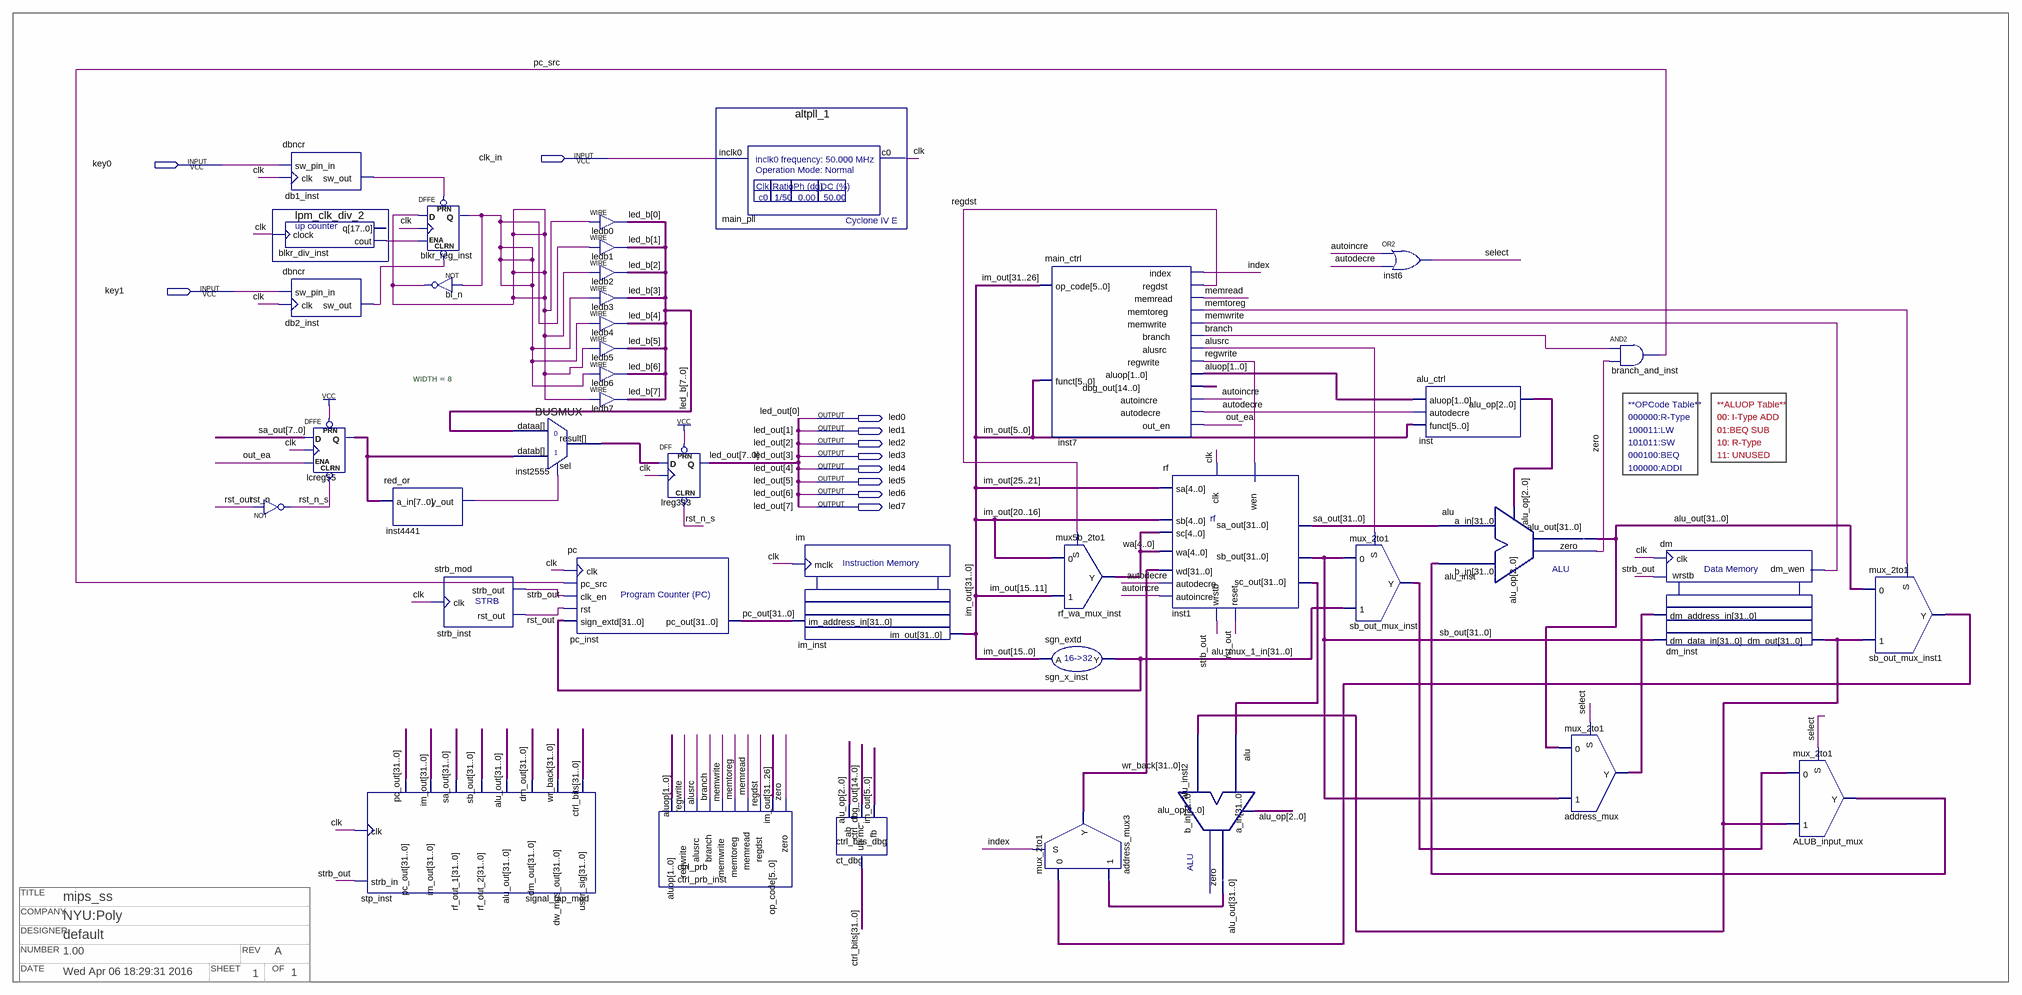
[diagram p0: schematic sheet]
// Quartus schematic mips_ss_v2.bdf as structural Verilog: 40 symbols, 11 pins
// Title block: COMPANY: NYU:Poly; DATE: Wed Apr 06 18:29:31 2016; DESIGNER: default; NUMBER: 1.00; OF: 1; REV: A; SHEET: 1; TITLE: mips_ss
module mips_ss_v2 (
  input  clk_in,
  input  key0,
  input  key1,
  output led0,
  output led1,
  output led2,
  output led3,
  output led4,
  output led5,
  output led6,
  output led7
);

  wire alusrc, autodecre, autoincre, bl_n_out, blkr_div_inst_cout, blkr_reg_inst_q, branch, clk,
       db1_inst_sw_out, db2_inst_sw_out, index, inst4441_y_out, memread, memtoreg, memwrite, out_ea, pc_src,
       regdst, regwrite, rst_n_s, rst_out, select, strb_out, zero;
  wire [1:0] aluop;
  wire [2:0] alu_op;
  wire [4:0] wa;
  wire [7:0] inst2555_result, lcreg55_q, led_b;
  wire [14:0] ctrl_dbg_out;
  wire [31:0] address_mux_out_bus, alu_b_in, alu_inst2_alu_out, alu_mux_1_in, alu_out,
       ALUB_input_mux_out_bus, ctrl_bits, dm_out, im_out, inst1_sc_out, pc_out, sa_out, sb_out,
       sb_out_mux_inst1_out_bus, wr_back;

  dbncr db1_inst (.sw_pin_in(key0), .clk(clk), .sw_out(db1_inst_sw_out));
  lpm_clk_div_2 blkr_div_inst (.clock(clk), .cout(blkr_div_inst_cout));  // open: q
  dbncr db2_inst (.sw_pin_in(key1), .clk(clk), .sw_out(db2_inst_sw_out));
  not rst_n (rst_n_s, rst_out);
  DFFE lcreg55[7:0] (.PRN(1'b1), .CLRN(rst_n_s), .D(sa_out[7:0]), .CLK(clk), .ENA(out_ea), .Q(lcreg55_q));
  red_or inst4441 (.a_in(lcreg55_q), .y_out(inst4441_y_out));
  signal_tap_mod stp_inst (
    .clk(clk), .pc_out(pc_out), .im_out(im_out), .rf_out_1(sa_out), .rf_out_2(sb_out), .alu_out(alu_out),
    .dm_out(dm_out), .dw_mus_out(wr_back), .user_sig(ctrl_bits), .strb_in(strb_out));
  DFFE blkr_reg_inst (
    .PRN(db1_inst_sw_out), .CLRN(db2_inst_sw_out), .D(bl_n_out), .CLK(clk), .ENA(blkr_div_inst_cout),
    .Q(blkr_reg_inst_q));
  not bl_n (bl_n_out, blkr_reg_inst_q);
  strb_mod strb_inst (.clk(clk), .rst_out(rst_out), .strb_out(strb_out));
  BUSMUX #(.WIDTH(8)) inst2555 (.datab(lcreg55_q), .sel(inst4441_y_out), .dataa(led_b), .result(inst2555_result));
  assign led_b[0] = bl_n_out;  // WIRE ledb0
  assign led_b[1] = blkr_reg_inst_q;  // WIRE ledb1
  assign led_b[2] = bl_n_out;  // WIRE ledb2
  assign led_b[3] = blkr_reg_inst_q;  // WIRE ledb3
  assign led_b[4] = blkr_reg_inst_q;  // WIRE ledb4
  assign led_b[5] = bl_n_out;  // WIRE ledb5
  assign led_b[6] = blkr_reg_inst_q;  // WIRE ledb6
  assign led_b[7] = bl_n_out;  // WIRE ledb7
  pc pc_inst (.clk(clk), .clk_en(strb_out), .rst(rst_out), .pc_src(pc_src), .sign_extd(alu_mux_1_in), .pc_out(pc_out));
  ctrl_prb ctrl_prb_inst (
    .op_code(im_out[31:26]), .regdst(regdst), .memread(memread), .memtoreg(memtoreg), .memwrite(memwrite),
    .branch(branch), .alusrc(alusrc), .aluop(aluop), .zero(zero), .regwrite(regwrite));
  DFF lreg333[7:0] (
    .CLRN(rst_n_s), .CLK(clk), .D(inst2555_result), .PRN(1'b1),
    .Q({led7, led6, led5, led4, led3, led2, led1, led0}));
  altpll_1 main_pll (.inclk0(clk_in), .c0(clk));
  im im_inst (.im_address_in(pc_out), .mclk(clk), .im_out(im_out));
  ctrl_bits_dbg ct_dbg (
    .main_ctrl(ctrl_dbg_out), .alu_op_bits(alu_op), .funct_bits(im_out[5:0]), .ctrl_dbg_out(ctrl_bits));
  main_ctrl inst7 (
    .op_code(im_out[31:26]), .funct(im_out[5:0]), .regdst(regdst), .memread(memread), .memtoreg(memtoreg),
    .memwrite(memwrite), .branch(branch), .alusrc(alusrc), .out_en(out_ea), .regwrite(regwrite),
    .aluop(aluop), .index(index), .autoincre(autoincre), .autodecre(autodecre), .dbg_out(ctrl_dbg_out));
  mux5b_2to1 rf_wa_mux_inst (.in_bus_0(im_out[20:16]), .in_bus_1(im_out[15:11]), .sel_input(regdst), .out_bus(wa));
  sgn_extd sgn_x_inst (.int_in(im_out[15:0]), .int_out(alu_mux_1_in));
  mux_2to1 address_mux3 (
    .in_bus_1(alu_inst2_alu_out), .in_bus_0(sb_out_mux_inst1_out_bus), .sel_input(index), .out_bus(wr_back));
  rf inst1 (
    .sc(wa), .sa(im_out[25:21]), .sb(im_out[20:16]), .autoincre(autoincre), .autodecre(autodecre),
    .wd(wr_back), .wa(wa), .wrstb(strb_out), .reset(rst_out), .wen(regwrite), .clk(clk),
    .sc_out(inst1_sc_out), .sa_out(sa_out), .sb_out(sb_out));
  alu alu_inst2 (.alu_op(alu_op), .a_in(inst1_sc_out), .b_in(dm_out), .alu_out(alu_inst2_alu_out));  // open: zero
  mux_2to1 sb_out_mux_inst (.in_bus_1(alu_mux_1_in), .in_bus_0(sb_out), .sel_input(alusrc), .out_bus(alu_b_in));
  or inst6 (select, autoincre, autodecre);
  alu_ctrl inst (.aluop(aluop), .funct(im_out[5:0]), .autodecre(autodecre), .alu_op(alu_op));
  alu alu_inst (.alu_op(alu_op), .a_in(sa_out), .b_in(ALUB_input_mux_out_bus), .alu_out(alu_out), .zero(zero));
  mux_2to1 address_mux (.in_bus_1(sb_out), .in_bus_0(alu_out), .sel_input(select), .out_bus(address_mux_out_bus));
  and branch_and_inst (pc_src, branch, zero);
  dm dm_inst (
    .dm_data_in(sb_out), .dm_wen(memwrite), .dm_address_in(address_mux_out_bus), .clk(clk), .wrstb(strb_out),
    .dm_out(dm_out));
  mux_2to1 ALUB_input_mux (
    .in_bus_1(dm_out), .in_bus_0(alu_b_in), .sel_input(select), .out_bus(ALUB_input_mux_out_bus));
  mux_2to1 sb_out_mux_inst1 (
    .in_bus_1(dm_out), .in_bus_0(alu_out), .sel_input(memtoreg), .out_bus(sb_out_mux_inst1_out_bus));

  // Other names for the same wires on the sheet: led_out[7:0] = {led7, led6, led5, led4, led3, led2, led1, led0}

  // Notes on the sheet:
  //   **OPCode Table**
  //   **ALUOP Table**
  //   000000:R-Type
  //   00: I-Type ADD
  //   100011:LW
  //   01:BEQ SUB
  //   101011:SW
  //   10: R-Type
  //   000100:BEQ
  //   11: UNUSED
  //   100000:ADDI
endmodule
